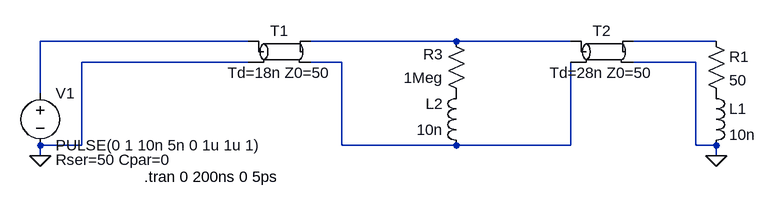
[diagram p0: schematic p1.match_sim.asc]
p1.match_sim.asc, the LTspice schematic file:
Version 4
SHEET 1 1192 680
WIRE 208 224 -112 224
WIRE 528 224 304 224
WIRE 704 224 528 224
WIRE 928 224 800 224
WIRE 208 256 -48 256
WIRE 352 256 304 256
WIRE 896 256 800 256
WIRE -112 304 -112 224
WIRE -48 384 -48 256
WIRE -48 384 -112 384
WIRE 352 384 352 256
WIRE 528 384 352 384
WIRE 704 384 704 256
WIRE 704 384 528 384
WIRE 896 384 896 256
WIRE 928 384 896 384
WIRE -112 400 -112 384
WIRE 928 400 928 384
FLAG -112 400 0
FLAG 928 400 0
SYMBOL tline 256 240 R0
SYMATTR InstName T1
SYMATTR Value Td=18n Z0=50
SYMBOL tline 752 240 R0
SYMATTR InstName T2
SYMATTR Value Td=28n Z0=50
SYMBOL Voltage -112 288 R0
WINDOW 39 24 118 Left 2
SYMATTR SpiceLine Rser=50 Cpar=0
SYMATTR InstName V1
SYMATTR Value PULSE(0 1 10n 5n 0 1u 1u 1)
SYMBOL Res 912 208 R0
SYMATTR InstName R1
SYMATTR Value 50
SYMBOL Ind 544 400 R180
WINDOW 0 36 80 Left 2
WINDOW 3 36 40 Left 2
SYMATTR InstName L2
SYMATTR Value 10n
SYMBOL Res 544 320 R180
WINDOW 0 36 76 Left 2
WINDOW 3 36 40 Left 2
SYMATTR InstName R3
SYMATTR Value 1Meg
SYMBOL Ind 912 288 R0
SYMATTR InstName L1
SYMATTR Value 10n
TEXT 48 432 Left 2 !.tran 0 200ns 0 5ps

The netlist it stands for:
* p1.match_sim.asc
T1 N001 0 N002 N004 Td=18n Z0=50
T2 N002 N004 N003 0 Td=28n Z0=50
V1 N001 0 PULSE(0 1 10n 5n 0 1u 1u 1) Rser=50 Cpar=0
R1 N003 P001 50
L2 N004 P002 10n
R3 P002 N002 1Meg
L1 P001 0 10n
.tran 0 200ns 0 5ps
.backanno
.end